# Altium schematic sheet 5_Non_Volatile_Memory.SchDoc: Non Volatile Memory
size A4; DrawnBy: Sara V. Martinez; Engineer: Flight; Revision: V0.0; SheetNumber: 5; SheetTotal: 7
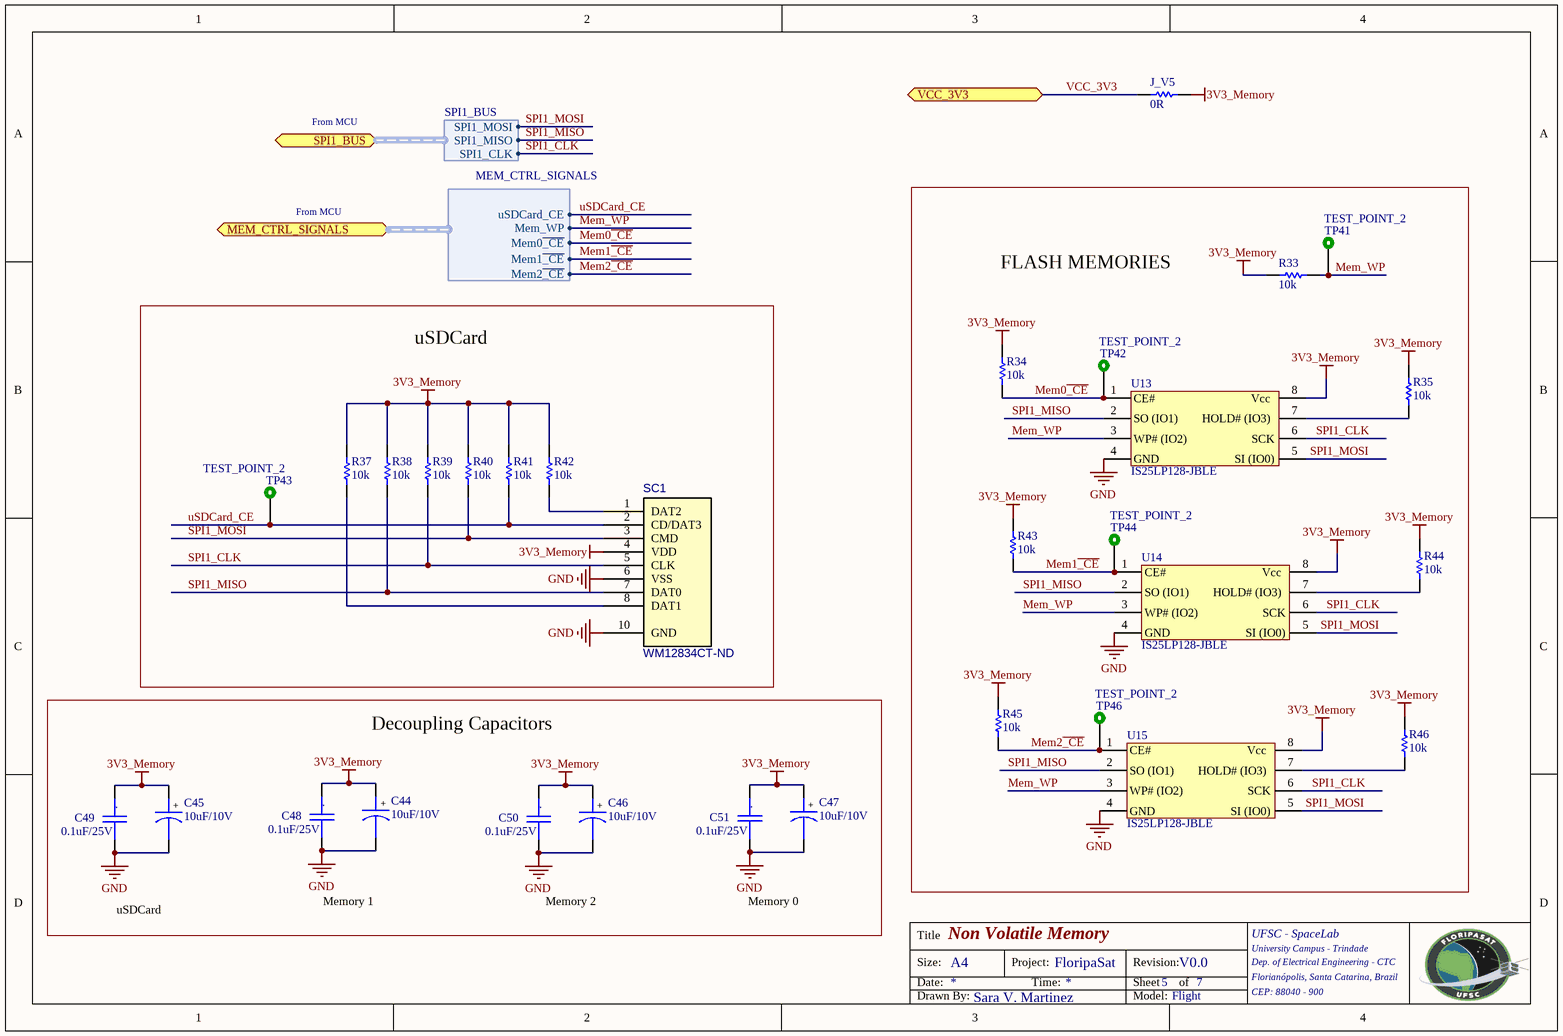
[diagram p0: 5_Non_Volatile_Memory.SchDoc]

## Parts
C44  10uF/10V  [CC0805_Tantalum]
C45  10uF/10V  [CC0805_Tantalum]
C46  10uF/10V  [CC0805_Tantalum]
C47  10uF/10V  [CC0805_Tantalum]
C48  0.1uF/25V  [CC0805]
C49  0.1uF/25V  [CC0805]
C50  0.1uF/25V  [CC0805]
C51  0.1uF/25V  [CC0805]
J_V5  0R  [0805]
R33  10k  [0805]
R34  10k  [0805]
R35  10k  [0805]
R37  10k  [0805]
R38  10k  [0805]
R39  10k  [0805]
R40  10k  [0805]
R41  10k  [0805]
R42  10k  [0805]
R43  10k  [0805]
R44  10k  [0805]
R45  10k  [0805]
R46  10k  [0805]
SC1  WM12834CT-ND  [uSD_Card]
TP41  TEST_POINT_2  [TEST_POINT_2]  (no BOM)
TP42  TEST_POINT_2  [TEST_POINT_2]  (no BOM)
TP43  TEST_POINT_2  [TEST_POINT_2]  (no BOM)
TP44  TEST_POINT_2  [TEST_POINT_2]  (no BOM)
TP46  TEST_POINT_2  [TEST_POINT_2]  (no BOM)
U13  IS25LP128-JBLE  [SOIC8]
U14  IS25LP128-JBLE  [SOIC8]
U15  IS25LP128-JBLE  [SOIC8]

## Blocks framed on the sheet
FLASH MEMORIES: R33-R35 R43-R46 TP41 TP42 TP44 TP46 U13-U15
uSDCard: R37-R42 SC1 TP43
Decoupling Capacitors: C44-C51

## Ports
MEM_CTRL_SIGNALS (harness MEM_CTRL_SIGNALS), SPI1_BUS (harness SPI1_BUS), VCC_3V3

## Harnesses
MEM_CTRL_SIGNALS: uSDCard_CE, Mem_WP, Mem0~{_CE}, Mem1~{_CE}, Mem2~{_CE}
SPI1_BUS: SPI1_CLK, SPI1_MISO, SPI1_MOSI

## Nets
3V3_Memory: C44.1 C45.1 C46.1 C47.1 C48.1 C49.1 C50.1 C51.1 J_V5.1 R33.2 R34.2 R35.2 R37.2 R38.2 R39.2 R40.2 R41.2 R42.2 R43.2 R44.2 R45.2 R46.2 SC1.4(VDD) U13.8(Vcc) U14.8(Vcc) U15.8(Vcc)
GND: C44.2 C45.2 C46.2 C47.2 C48.2 C49.2 C50.2 C51.2 SC1.6(VSS) SC1.10(GND) U13.4(GND) U14.4(GND) U15.4(GND)
Mem0~{_CE}: R34.1 TP42.1 U13.1(CE#) ; port MEM_CTRL_SIGNALS.Mem0~{_CE}
Mem1~{_CE}: R43.1 TP44.1 U14.1(CE#) ; port MEM_CTRL_SIGNALS.Mem1~{_CE}
Mem2~{_CE}: R45.1 TP46.1 U15.1(CE#) ; port MEM_CTRL_SIGNALS.Mem2~{_CE}
Mem_WP: R33.1 TP41.1 U13.3(WP#_(IO2)) U14.3(WP#_(IO2)) U15.3(WP#_(IO2)) ; port MEM_CTRL_SIGNALS.Mem_WP
SPI1_CLK: R39.1 SC1.5(CLK) U13.6(SCK) U14.6(SCK) U15.6(SCK) ; port SPI1_BUS.SPI1_CLK
SPI1_MISO: R38.1 SC1.7(DAT0) U13.2(SO_(IO1)) U14.2(SO_(IO1)) U15.2(SO_(IO1)) ; port SPI1_BUS.SPI1_MISO
SPI1_MOSI: R40.1 SC1.3(CMD) U13.5(SI_(IO0)) U14.5(SI_(IO0)) U15.5(SI_(IO0)) ; port SPI1_BUS.SPI1_MOSI
uSDCard_CE: R41.1 SC1.2(CD/DAT3) TP43.1 ; port MEM_CTRL_SIGNALS.uSDCard_CE
VCC_3V3: J_V5.2 ; port VCC_3V3
NetR35_1: R35.1 U13.7(HOLD#_(IO3))
NetR37_1: R37.1 SC1.8(DAT1)
NetR42_1: R42.1 SC1.1(DAT2)
NetR44_1: R44.1 U14.7(HOLD#_(IO3))
NetR46_1: R46.1 U15.7(HOLD#_(IO3))

## Notes on the sheet
- From MCU
- uSDCard
- Memory 1
- Memory 2
- Memory 0
- Title
- Size:
- Date:
- A4
- Project:
- Time:
- FloripaSat
- Revision:
- Sheet
- of
- UFSC - SpaceLab
- University Campus - Trindade
- Dep. of Electrical Engineering - CTC
- Florianópolis, Santa Catarina, Brazil
- Drawn By:
- Model:
- CEP: 88040 - 900
- (in symbol Cap_Cer_X7R_0.1uF_25V_0805) .
- (in symbol Cap_Tant_SMD_10uF_10V_0805) +

## Library data of the parts
C44-C47 = Cap_Tant_SMD_10uF_10V_0805: CAP Tantalum 10uF 10V 20% 0805; Partnumber: TPSP106M010R2000; NCM: 8532.21.11
C48-C51 = Cap_Cer_X7R_0.1uF_25V_0805: CAP CER 0.1UF 25V 10% X7R 0805; Partnumber: CC0805KRX7R8BB104; NCM: 8532.24.10
J_V5 = R0R_JUMPER_1/16W_0805: RES 0R OHM 1/16W JUMPER 0805; Partnumber: CRCW08050000Z0EA; NCM: 8533.21.20
R33-R35 R37-R46 = R10k_1%_1/8W_0805: RES 10K OHM 1/8W 1%  0805; Partnumber: CRCW080510K0FKEA; NCM: 8533.21.20
SC1 = MicroSD_Card_Connector: MicroSD CARD Connector; Partnumber: WM12834CT-ND; NCM: 8536.90.40
TP41-TP44 TP46 = TEST_POINT_2: Test point
U13-U15 = IS25LP128-JBLE: IC FLASH 128MBIT 133MHZ 8SOIC; Partnumber: IS25LP128-JBLE